# EAGLE schematic ADS1299-shield (EAGLE 6.5.0)

## Sheet 1 of 3
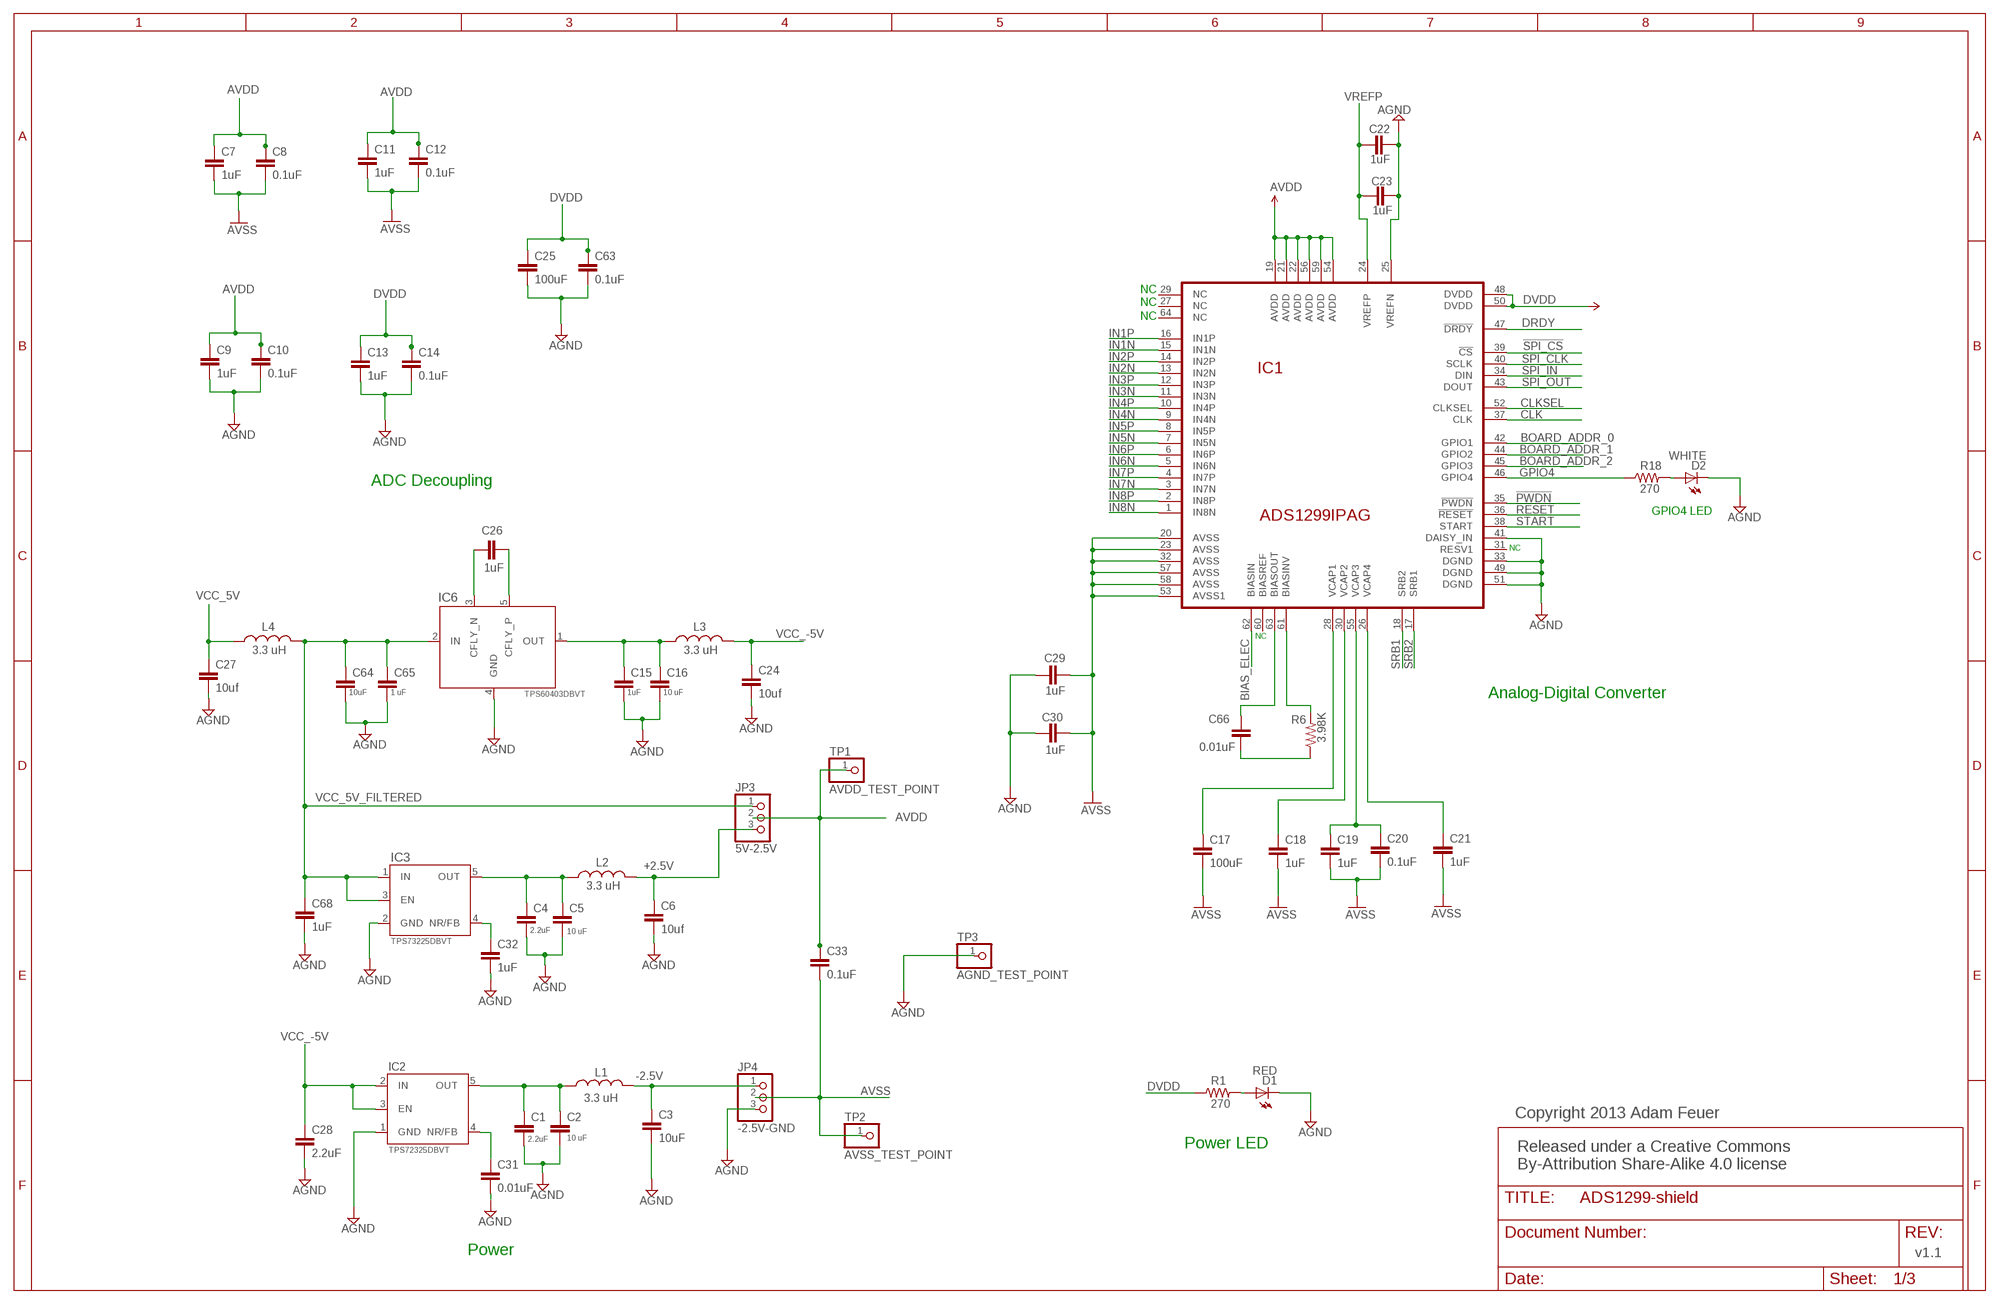
[diagram p0: schematic, sheet 1]

### Parts
C1  2.2uF  CAP0603-CAP  [0603-CAP]
C2  10 uF  CAP0603-CAP  [0603-CAP]
C3  10uF  CAP0603-CAP  [0603-CAP]
C4  2.2uF  CAP0603-CAP  [0603-CAP]
C5  10 uF  CAP0603-CAP  [0603-CAP]
C6  10uf  CAP0603-CAP  [0603-CAP]
C7  1uF  CAP0603-CAP  [0603-CAP]
C8  0.1uF  CAP0603-CAP  [0603-CAP]
C9  1uF  CAP0603-CAP  [0603-CAP]
C10  0.1uF  CAP0603-CAP  [0603-CAP]
C11  1uF  CAP0603-CAP  [0603-CAP]
C12  0.1uF  CAP0603-CAP  [0603-CAP]
C13  1uF  CAP0603-CAP  [0603-CAP]
C14  0.1uF  CAP0603-CAP  [0603-CAP]
C15  1uF  CAP0603-CAP  [0603-CAP]
C16  10 uF  CAP0603-CAP  [0603-CAP]
C17  100uF  CAP1210  [1210]
C18  1uF  CAP0603-CAP  [0603-CAP]
C19  1uF  CAP0603-CAP  [0603-CAP]
C20  0.1uF  CAP0603-CAP  [0603-CAP]
C21  1uF  CAP0603-CAP  [0603-CAP]
C22  1uF  CAP0603-CAP  [0603-CAP]
C23  1uF  CAP0603-CAP  [0603-CAP]
C24  10uf  CAP0603-CAP  [0603-CAP]
C25  100uF  CAP1210  [1210]
C26  1uF  CAP0603-CAP  [0603-CAP]
C27  10uf  CAP0603-CAP  [0603-CAP]
C28  2.2uF  CAP0603-CAP  [0603-CAP]
C29  1uF  CAP0603-CAP  [0603-CAP]
C30  1uF  CAP0603-CAP  [0603-CAP]
C31  0.01uF  CAP0603-CAP  [0603-CAP]
C32  1uF  CAP0603-CAP  [0603-CAP]
C33  0.1uF  CAP0603-CAP  [0603-CAP]
C63  0.1uF  CAP0603-CAP  [0603-CAP]
C64  10uF  CAP0603-CAP  [0603-CAP]
C65  1 uF  CAP0603-CAP  [0603-CAP]
C66  0.01uF  CAP0603-CAP  [0603-CAP]
C68  1uF  CAP0603-CAP  [0603-CAP]
D1  RED  LED-RED1206  [LED-1206]
D2  WHITE  LED-WHITE  [LED-1206]
IC1  ADS1299IPAG  ADS1299*PAG*  [TQFP64]
IC2  TPS72325DBVT  TPS732XXDBV  [SOT23-5]
IC3  TPS73225DBVT  TPS732XXDBV  [SOT23-5]
IC6  TPS60403DBVT  TPS604XXDBV  [SOT23-5]
JP3  5V-2.5V  PINHD-1X3  [1X03]
JP4  -2.5V-GND  PINHD-1X3  [1X03]
L1  3.3 uH  INDUCTOR0805  [0805]
L2  3.3 uH  INDUCTOR0805  [0805]
L3  3.3 uH  INDUCTOR0805  [0805]
L4  3.3 uH  INDUCTOR0805  [0805]
R1  270  RESISTOR0603-RES  [0603-RES]
R6  3.98K  RESISTOR0603-RES  [0603-RES]
R18  270  RESISTOR0603-RES  [0603-RES]
TP1  AVDD_TEST_POINT  PINHD-1X1  [1X01]
TP2  AVSS_TEST_POINT  PINHD-1X1  [1X01]
TP3  AGND_TEST_POINT  PINHD-1X1  [1X01]

### Nets
!PWDN: IC1.35(!PWDN) ; also sheet 3
!RESET: IC1.36(!RESET) ; also sheet 3
!SPI_CS: IC1.39(!CS) ; also sheet 3
+2.5V: C6.1 JP3.3 L2.2
-2.5V: C3.1 JP4.1 L1.2
AGND: C1.2 C2.2 C3.2 C4.2 C5.2 C6.2 C9.2 C10.2 C13.2 C14.2 C15.2 C16.2 C22.2 C23.2 C24.2 C25.2 C27.2 C28.2 C29.1 C30.1 C31.2 C32.2 C63.2 C64.2 C65.2 C68.2 D1.C D2.C IC1.25(VREFN) IC1.33(DGND) IC1.41(DAISY_IN) IC1.49(DGND) IC1.51(DGND) IC2.1(GND) IC3.2(GND) IC6.4(GND) JP4.3 TP3.1 ; also sheet 2,3
AVDD: C7.1 C8.1 C9.1 C10.1 C11.1 C12.1 C33.1 IC1.19(AVDD) IC1.21(AVDD) IC1.22(AVDD) IC1.54(AVDD) IC1.56(AVDD) IC1.59(AVDD) JP3.2 TP1.1 ; also sheet 2
AVSS: C7.2 C8.2 C11.2 C12.2 C17.2 C18.2 C19.2 C20.2 C21.2 C29.2 C30.2 C33.2 IC1.20(AVSS) IC1.23(AVSS) IC1.32(AVSS) IC1.53(AVSS1) IC1.57(AVSS) IC1.58(AVSS) JP4.2 TP2.1 ; also sheet 2
BIAS_ELEC: IC1.62(BIASIN) ; also sheet 2
BOARD_ADDR_0: IC1.42(GPIO1) ; also sheet 3
BOARD_ADDR_1: IC1.44(GPIO2) ; also sheet 3
BOARD_ADDR_2: IC1.45(GPIO3) ; also sheet 3
CLK: IC1.37(CLK) ; also sheet 3
CLKSEL: IC1.52(CLKSEL) ; also sheet 3
DRDY: IC1.47(!DRDY) ; also sheet 3
DVDD: C13.1 C14.1 C25.1 C63.1 IC1.48(DVDD) IC1.50(DVDD) R1.1 ; also sheet 2,3
GPIO4: IC1.46(GPIO4) R18.1
IN1N: IC1.15(IN1N) ; also sheet 2
IN1P: IC1.16(IN1P) ; also sheet 2
IN2N: IC1.13(IN2N) ; also sheet 2
IN2P: IC1.14(IN2P) ; also sheet 2
IN3N: IC1.11(IN3N) ; also sheet 2
IN3P: IC1.12(IN3P) ; also sheet 2
IN4N: IC1.9(IN4N) ; also sheet 2
IN4P: IC1.10(IN4P) ; also sheet 2
IN5N: IC1.7(IN5N) ; also sheet 2
IN5P: IC1.8(IN5P) ; also sheet 2
IN6N: IC1.5(IN6N) ; also sheet 2
IN6P: IC1.6(IN6P) ; also sheet 2
IN7N: IC1.3(IN7N) ; also sheet 2
IN7P: IC1.4(IN7P) ; also sheet 2
IN8N: IC1.1(IN8N) ; also sheet 2
IN8P: IC1.2(IN8P) ; also sheet 2
N$1: C4.1 C5.1 IC3.5(OUT) L2.1
N$2: C1.1 C2.1 IC2.5(OUT) L1.1
N$3: C17.1 IC1.28(VCAP1)
N$4: C18.1 IC1.30(VCAP2)
N$5: C19.1 C20.1 IC1.55(VCAP3)
N$7: C15.1 C16.1 IC6.1(OUT) L3.1
N$8: C21.1 IC1.26(VCAP4)
N$9: C26.2 IC6.5(CFLY_P)
N$10: C26.1 IC6.3(CFLY_N)
N$11: C32.1 IC3.4(NR/FB)
N$12: IC1.61(BIASINV) R6.2
N$13: C31.1 IC2.4(NR/FB)
N$14: D2.A R18.2
N$19: D1.A R1.2
N$22: C66.2 R6.1
N$25: C66.1 IC1.63(BIASOUT)
SPI_CLK: IC1.40(SCLK) ; also sheet 3
SPI_IN: IC1.34(DIN) ; also sheet 3
SPI_OUT: IC1.43(DOUT) ; also sheet 3
SRB1: IC1.18(SRB2) ; also sheet 2
SRB2: IC1.17(SRB1) ; also sheet 2
START: IC1.38(START) ; also sheet 3
VCC_5V: C27.1 L4.1 ; also sheet 3
VCC_5V_FILTERED: C64.1 C65.1 C68.1 IC3.1(IN) IC3.3(EN) IC6.2(IN) JP3.1 L4.2
VCC_-5V: C24.1 C28.1 IC2.2(IN) IC2.3(EN) L3.2
VREFP: C22.1 C23.1 IC1.24(VREFP)
Unconnected: IC1.27(NC) IC1.29(NC) IC1.31(RESV1) IC1.60(BIASREF) IC1.64(NC)

### Notes on the sheet
- NC
- NC
- NC
- ADC Decoupling
- GPIO4 LED
- NC
- NC
- Analog-Digital Converter
- Copyright 2013 Adam Feuer
- Power LED
- Released under a Creative Commons 
  By-Attribution Share-Alike 4.0 license
- Power | v1.1

## Sheet 2 of 3
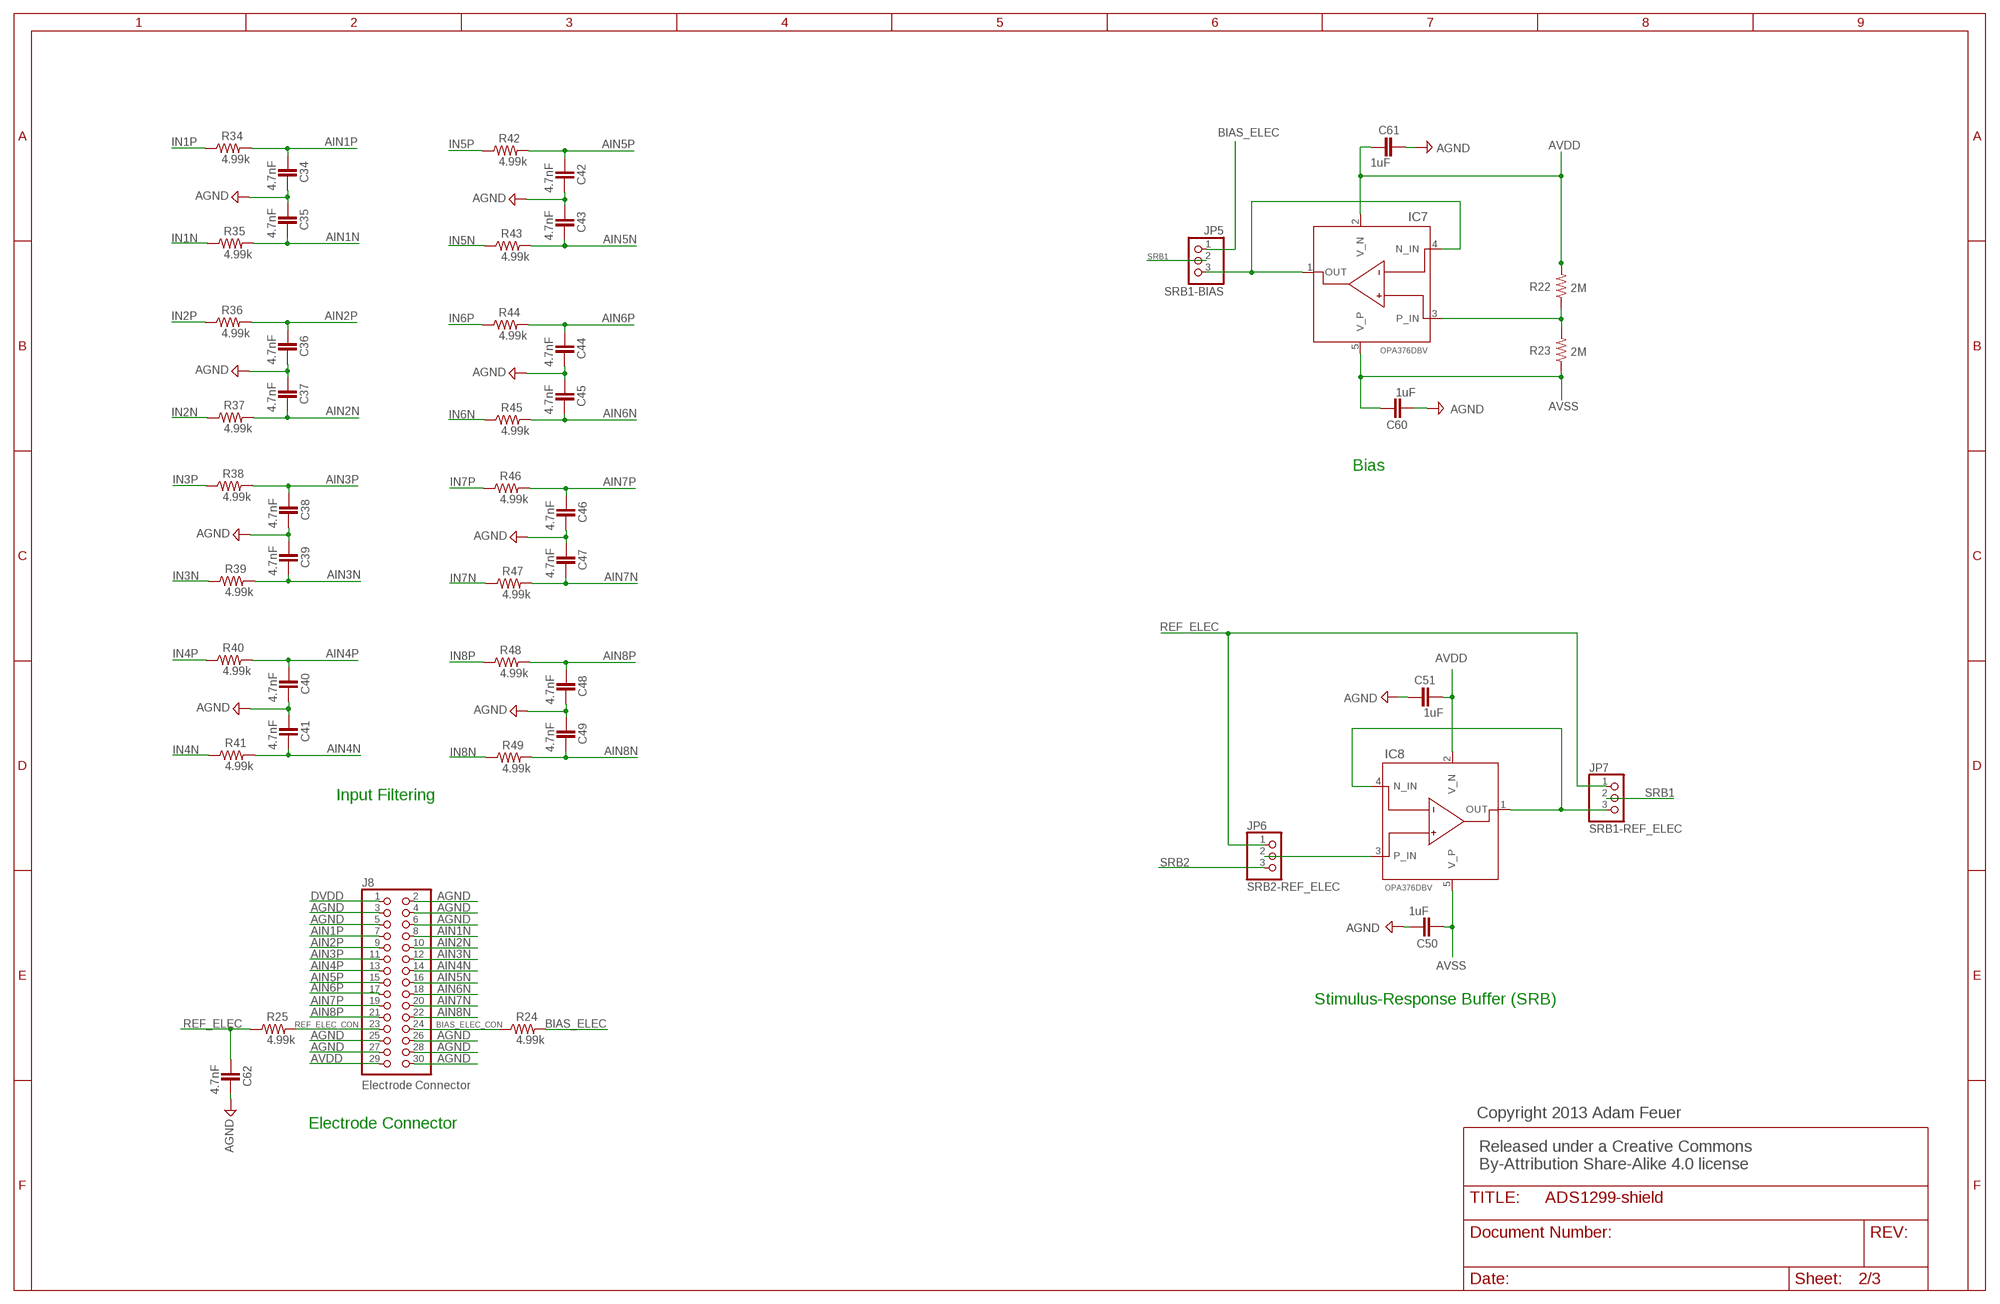
[diagram p1: schematic, sheet 2]

### Parts
C34  4.7nF  CAP0603-CAP  [0603-CAP]
C35  4.7nF  CAP0603-CAP  [0603-CAP]
C36  4.7nF  CAP0603-CAP  [0603-CAP]
C37  4.7nF  CAP0603-CAP  [0603-CAP]
C38  4.7nF  CAP0603-CAP  [0603-CAP]
C39  4.7nF  CAP0603-CAP  [0603-CAP]
C40  4.7nF  CAP0603-CAP  [0603-CAP]
C41  4.7nF  CAP0603-CAP  [0603-CAP]
C42  4.7nF  CAP0603-CAP  [0603-CAP]
C43  4.7nF  CAP0603-CAP  [0603-CAP]
C44  4.7nF  CAP0603-CAP  [0603-CAP]
C45  4.7nF  CAP0603-CAP  [0603-CAP]
C46  4.7nF  CAP0603-CAP  [0603-CAP]
C47  4.7nF  CAP0603-CAP  [0603-CAP]
C48  4.7nF  CAP0603-CAP  [0603-CAP]
C49  4.7nF  CAP0603-CAP  [0603-CAP]
C50  1uF  CAP0603-CAP  [0603-CAP]
C51  1uF  CAP0603-CAP  [0603-CAP]
C60  1uF  CAP0603-CAP  [0603-CAP]
C61  1uF  CAP0603-CAP  [0603-CAP]
C62  4.7nF  CAP0603-CAP  [0603-CAP]
IC7  OPA376DBV  [SOT23-5]
IC8  OPA376DBV  [SOT23-5]
J8  Electrode Connector  PINHD-2X15  [2X15]
JP5  SRB1-BIAS  PINHD-1X3  [1X03]
JP6  SRB2-REF_ELEC  PINHD-1X3  [1X03]
JP7  SRB1-REF_ELEC  PINHD-1X3  [1X03]
R22  2M  RESISTOR0603-RES  [0603-RES]
R23  2M  RESISTOR0603-RES  [0603-RES]
R24  4.99k  RESISTOR0603-RES  [0603-RES]
R25  4.99k  RESISTOR0603-RES  [0603-RES]
R34  4.99k  RESISTOR0603-RES  [0603-RES]
R35  4.99k  RESISTOR0603-RES  [0603-RES]
R36  4.99k  RESISTOR0603-RES  [0603-RES]
R37  4.99k  RESISTOR0603-RES  [0603-RES]
R38  4.99k  RESISTOR0603-RES  [0603-RES]
R39  4.99k  RESISTOR0603-RES  [0603-RES]
R40  4.99k  RESISTOR0603-RES  [0603-RES]
R41  4.99k  RESISTOR0603-RES  [0603-RES]
R42  4.99k  RESISTOR0603-RES  [0603-RES]
R43  4.99k  RESISTOR0603-RES  [0603-RES]
R44  4.99k  RESISTOR0603-RES  [0603-RES]
R45  4.99k  RESISTOR0603-RES  [0603-RES]
R46  4.99k  RESISTOR0603-RES  [0603-RES]
R47  4.99k  RESISTOR0603-RES  [0603-RES]
R48  4.99k  RESISTOR0603-RES  [0603-RES]
R49  4.99k  RESISTOR0603-RES  [0603-RES]

### Nets
AGND: C34.2 C35.1 C36.2 C37.1 C38.2 C39.1 C40.2 C41.1 C42.2 C43.1 C44.2 C45.1 C46.2 C47.1 C48.2 C49.1 C50.2 C51.1 C60.2 C61.1 C62.2 J8.2 J8.3 J8.4 J8.5 J8.6 J8.25 J8.26 J8.27 J8.28 J8.30 ; also sheet 1,3
AIN1N: C35.2 J8.8 R35.2
AIN1P: C34.1 J8.7 R34.2
AIN2N: C37.2 J8.10 R37.2
AIN2P: C36.1 J8.9 R36.2
AIN3N: C39.2 J8.12 R39.2
AIN3P: C38.1 J8.11 R38.2
AIN4N: C41.2 J8.14 R41.2
AIN4P: C40.1 J8.13 R40.2
AIN5N: C43.2 J8.16 R43.2
AIN5P: C42.1 J8.15 R42.2
AIN6N: C45.2 J8.18 R45.2
AIN6P: C44.1 J8.17 R44.2
AIN7N: C47.2 J8.20 R47.2
AIN7P: C46.1 J8.19 R46.2
AIN8N: C49.2 J8.22 R49.2
AIN8P: C48.1 J8.21 R48.2
AVDD: C51.2 C61.2 IC7.2(V_N) IC8.2(V_N) J8.29 R22.2 ; also sheet 1
AVSS: C50.1 C60.1 IC7.5(V_P) IC8.5(V_P) R23.1 ; also sheet 1
BIAS_ELEC: JP5.1 R24.2 ; also sheet 1
BIAS_ELEC_CON: J8.24 R24.1
DVDD: J8.1 ; also sheet 1,3
IN1N: R35.1 ; also sheet 1
IN1P: R34.1 ; also sheet 1
IN2N: R37.1 ; also sheet 1
IN2P: R36.1 ; also sheet 1
IN3N: R39.1 ; also sheet 1
IN3P: R38.1 ; also sheet 1
IN4N: R41.1 ; also sheet 1
IN4P: R40.1 ; also sheet 1
IN5N: R43.1 ; also sheet 1
IN5P: R42.1 ; also sheet 1
IN6N: R45.1 ; also sheet 1
IN6P: R44.1 ; also sheet 1
IN7N: R47.1 ; also sheet 1
IN7P: R46.1 ; also sheet 1
IN8N: R49.1 ; also sheet 1
IN8P: R48.1 ; also sheet 1
N$15: IC7.3(P_IN) R22.1 R23.2
N$16: IC8.3(P_IN) JP6.2
N$17: IC8.1(OUT) IC8.4(N_IN) JP7.3
N$18: IC7.1(OUT) IC7.4(N_IN) JP5.3
REF_ELEC: C62.1 JP6.1 JP7.1 R25.1
REF_ELEC_CON: J8.23 R25.2
SRB1: JP5.2 JP7.2 ; also sheet 1
SRB2: JP6.3 ; also sheet 1

### Notes on the sheet
- Bias
- Input Filtering
- Stimulus-Response Buffer (SRB)
- Copyright 2013 Adam Feuer
- Electrode Connector
- Released under a Creative Commons 
  By-Attribution Share-Alike 4.0 license

## Sheet 3 of 3: PCB Matrix Packages
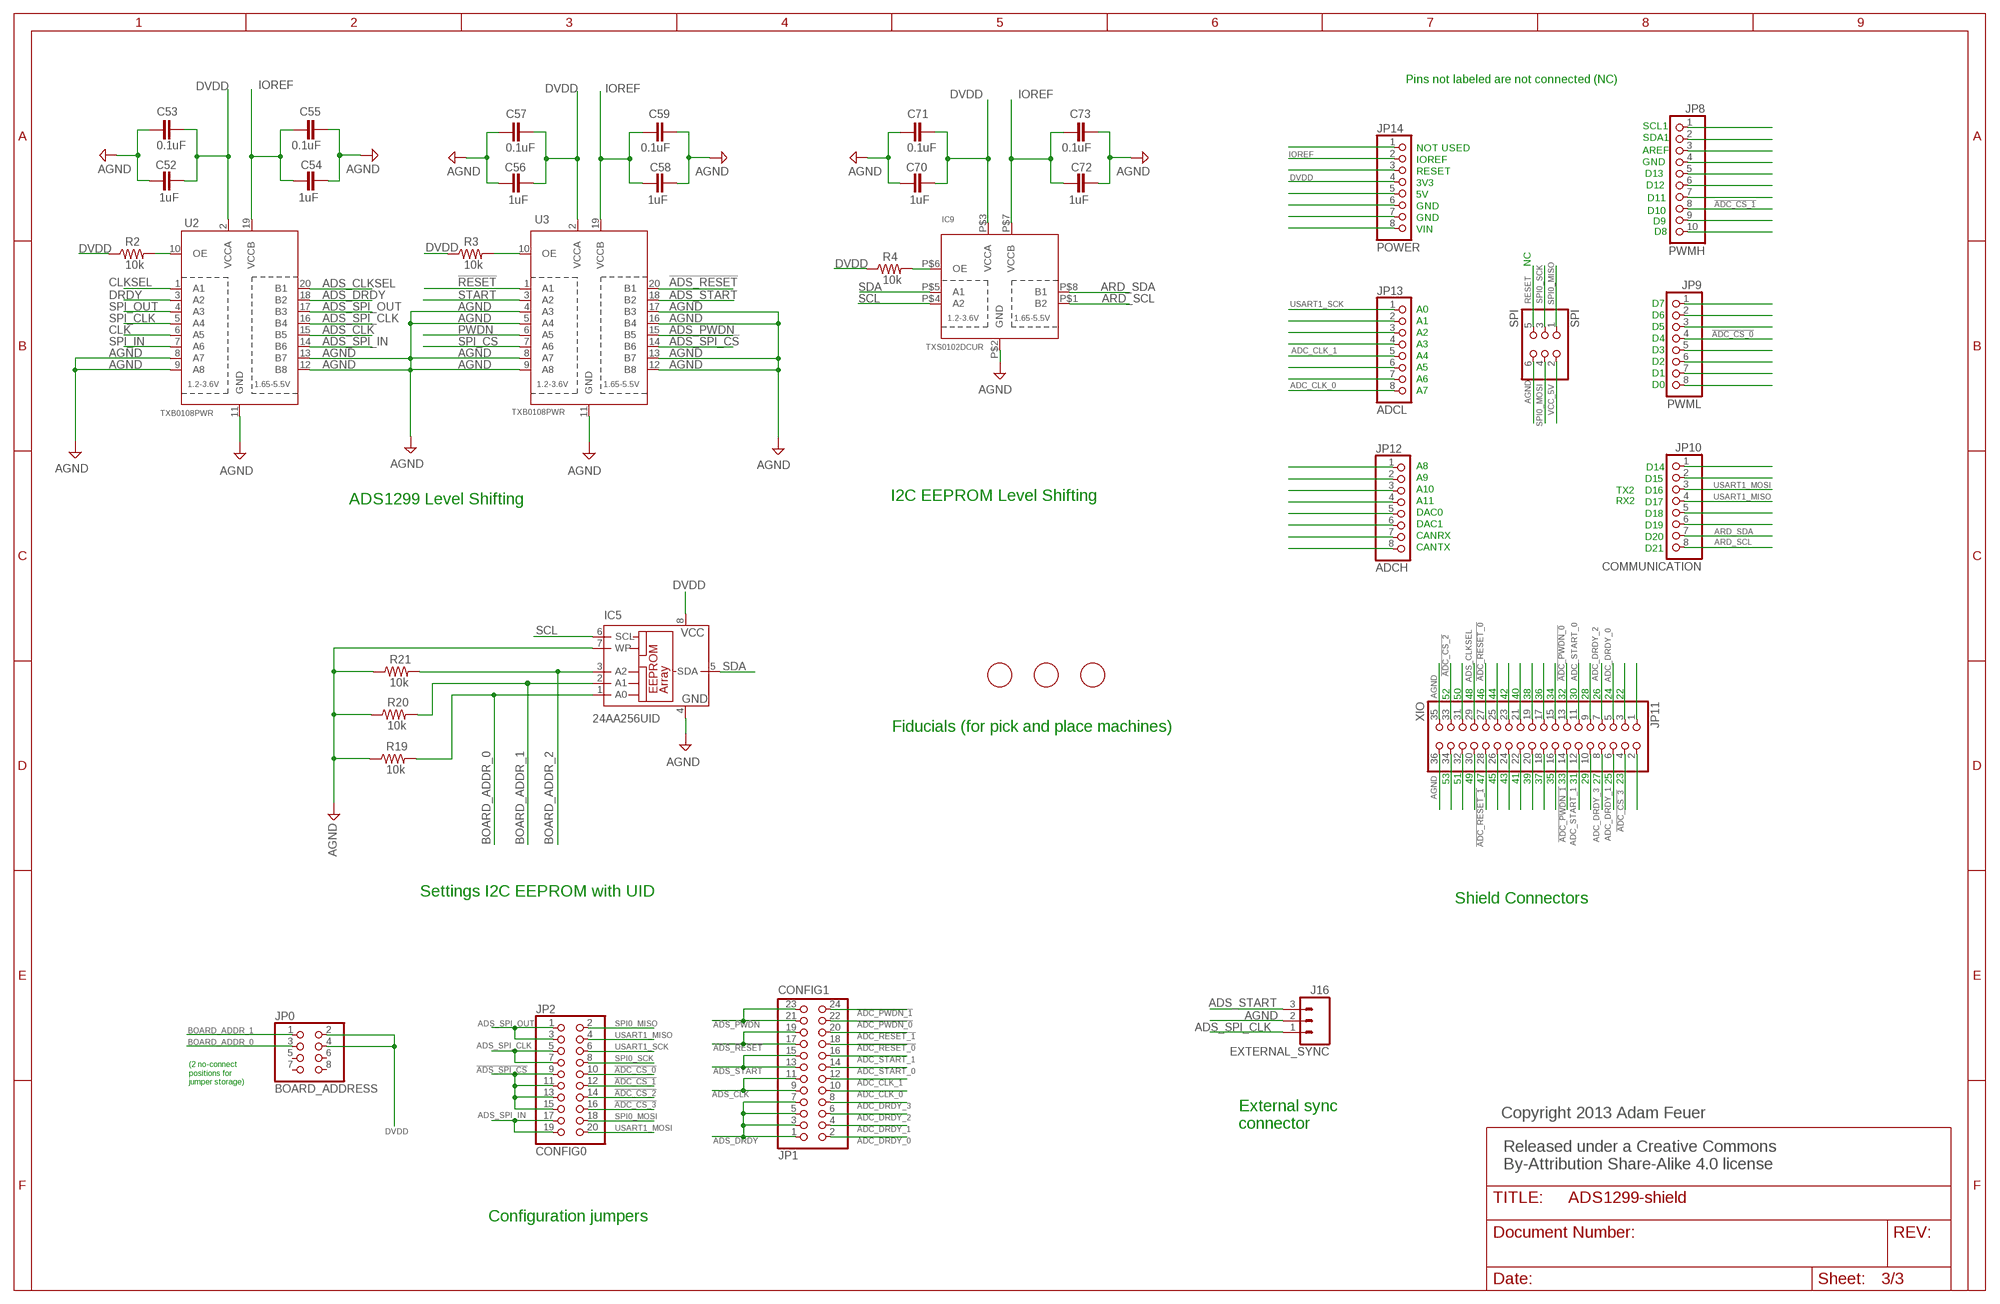
[diagram p2: schematic, sheet 3]

### Parts
C52  1uF  CAP0603-CAP  [0603-CAP]
C53  0.1uF  CAP0603-CAP  [0603-CAP]
C54  1uF  CAP0603-CAP  [0603-CAP]
C55  0.1uF  CAP0603-CAP  [0603-CAP]
C56  1uF  CAP0603-CAP  [0603-CAP]
C57  0.1uF  CAP0603-CAP  [0603-CAP]
C58  1uF  CAP0603-CAP  [0603-CAP]
C59  0.1uF  CAP0603-CAP  [0603-CAP]
C70  1uF  CAP0603-CAP  [0603-CAP]
C71  0.1uF  CAP0603-CAP  [0603-CAP]
C72  1uF  CAP0603-CAP  [0603-CAP]
C73  0.1uF  CAP0603-CAP  [0603-CAP]
IC5  24AA256UID  24LC256SN  [SO-08]
IC9  TXS0102DCUR  TXS0102  [VFSOP-8]
J16  EXTERNAL_SYNC  M03JST-PTH  [JST-3-PTH]
JP0  BOARD_ADDRESS  PINHD-2X4  [2X04]
JP1  CONFIG1  PINHD-2X12  [2X12]
JP2  CONFIG0  PINHD-2X10  [2X10]
JP8  PWMH  PINHD-1X10  [1X10]
JP9  PWML  PINHD-1X8  [1X08]
JP10  COMMUNICATION  PINHD-1X8  [1X08]
JP11  XIO  PINHD-2X18  [2X18]
JP12  ADCH  PINHD-1X8  [1X08]
JP13  ADCL  PINHD-1X8  [1X08]
JP14  POWER  PINHD-1X8  [1X08]
R2  10k  RESISTOR0603-RES  [0603-RES]
R3  10k  RESISTOR0603-RES  [0603-RES]
R4  10k  RESISTOR0603-RES  [0603-RES]
R19  10k  RESISTOR0603-RES  [0603-RES]
R20  10k  RESISTOR0603-RES  [0603-RES]
R21  10k  RESISTOR0603-RES  [0603-RES]
SPI  SPI  PINHD-2X3  [2X03]
U2  TXB0108PWR  [TSSOP20]
U3  TXB0108PWR  [TSSOP20]
U$2  FIDUCIAL  [FIDUCIAL_1MM]
U$5  FIDUCIAL  [FIDUCIAL_1MM]
U$6  FIDUCIAL  [FIDUCIAL_1MM]

### Nets
!ADC_CS_0: JP2.10 JP9.4
!ADC_CS_1: JP2.12 JP8.8
!ADC_CS_2: JP2.14 JP11.33
!ADC_CS_3: JP2.16 JP11.4
!ADC_PWDN_0: JP1.22 JP11.13
!ADC_PWDN_1: JP1.24 JP11.14
!ADC_RESET_0: JP1.18 JP11.27
!ADC_RESET_1: JP1.20 JP11.28
!ADS_PWDN: JP1.21 JP1.23 U3.15(B5)
!ADS_RESET: JP1.17 JP1.19 U3.20(B1)
!ADS_SPI_CS: JP2.9 JP2.11 JP2.13 JP2.15 U3.14(B6)
!PWDN: U3.6(A5) ; also sheet 1
!RESET: U3.1(A1) ; also sheet 1
!SPI_CS: U3.7(A6) ; also sheet 1
ADC_CLK_0: JP1.10 JP13.8
ADC_CLK_1: JP1.12 JP13.5
ADC_DRDY_0: JP1.2 JP11.5
ADC_DRDY_1: JP1.4 JP11.6
ADC_DRDY_2: JP1.6 JP11.7
ADC_DRDY_3: JP1.8 JP11.8
ADC_START_0: JP1.14 JP11.11
ADC_START_1: JP1.16 JP11.12
ADS_CLK: JP1.9 JP1.11 U2.15(B5)
ADS_CLKSEL: JP11.29 U2.20(B1)
ADS_DRDY: JP1.1 JP1.3 JP1.5 JP1.7 U2.18(B2)
ADS_SPI_CLK: J16.1 JP2.5 JP2.7 U2.16(B4)
ADS_SPI_IN: JP2.17 JP2.19 U2.14(B6)
ADS_SPI_OUT: JP2.1 JP2.3 U2.17(B3)
ADS_START: J16.3 JP1.13 JP1.15 U3.18(B2)
AGND: C52.1 C53.1 C54.1 C55.1 C56.1 C57.1 C58.1 C59.1 C70.1 C71.1 C72.1 C73.1 IC5.4(GND) IC5.7(WP) IC9.P$2(GND) J16.2 JP11.35 JP11.36 R19.1 R20.1 R21.1 SPI.6 U2.8(A7) U2.9(A8) U2.11(GND) U2.12(B8) U2.13(B7) U3.4(A3) U3.5(A4) U3.8(A7) U3.9(A8) U3.11(GND) U3.12(B8) U3.13(B7) U3.16(B4) U3.17(B3) ; also sheet 1,2
ARD_SCL: IC9.P$1(B2) JP10.8
ARD_SDA: IC9.P$8(B1) JP10.7
BOARD_ADDR_0: IC5.1(A0) JP0.3 R19.2 ; also sheet 1
BOARD_ADDR_1: IC5.2(A1) JP0.1 R20.2 ; also sheet 1
BOARD_ADDR_2: IC5.3(A2) R21.2 ; also sheet 1
CLK: U2.6(A5) ; also sheet 1
CLKSEL: U2.1(A1) ; also sheet 1
DRDY: U2.3(A2) ; also sheet 1
DVDD: C52.2 C53.2 C56.2 C57.2 C70.2 C71.2 IC5.8(VCC) IC9.P$3(VCCA) JP0.2 JP0.4 JP14.4 R2.1 R3.1 R4.1 U2.2(VCCA) U3.2(VCCA) ; also sheet 1,2
IOREF: C54.2 C55.2 C58.2 C59.2 C72.2 C73.2 IC9.P$7(VCCB) JP14.2 U2.19(VCCB) U3.19(VCCB)
N$6: JP8.9
N$20: JP12.1
N$21: JP14.1
N$24: JP9.7
N$27: JP8.3
N$28: JP8.4
N$29: JP8.5
N$30: JP8.6
N$31: JP8.7
N$33: JP8.10
N$34: JP9.1
N$35: JP9.2
N$36: JP9.3
N$37: IC9.P$6(OE) R4.2
N$38: JP9.5
N$39: JP9.6
N$40: JP9.8
N$41: JP10.1
N$42: JP10.2
N$45: JP10.5
N$46: JP10.6
N$48: JP12.8
N$49: JP12.7
N$50: JP12.6
N$51: JP12.5
N$52: JP12.4
N$53: JP12.3
N$54: JP12.2
N$59: JP13.4
N$60: JP13.3
N$61: JP13.2
N$62: JP14.8
N$63: JP14.7
N$64: JP14.6
N$67: JP14.3
N$78: JP11.34
N$79: JP11.32
N$80: JP11.30
N$82: JP11.26
N$83: JP11.24
N$84: JP11.22
N$85: JP11.20
N$86: JP11.18
N$87: JP11.16
N$90: JP11.10
N$95: JP11.3
N$98: JP11.9
N$101: JP11.15
N$102: JP11.17
N$103: JP11.19
N$104: JP11.21
N$107: JP11.23
N$108: JP11.25
N$111: JP11.31
N$501: JP13.7
N$510: JP13.6
N$561: R2.2 U2.10(OE)
N$562: R3.2 U3.10(OE)
N$570: JP14.5
N$571: JP11.1
N$572: JP11.2
N$6001: JP8.2
N$6002: JP8.1
RESET: SPI.5
SCL: IC5.6(SCL) IC9.P$4(A2)
SDA: IC5.5(SDA) IC9.P$5(A1)
SPI0_MISO: JP2.2 SPI.1
SPI0_MOSI: JP2.18 SPI.4
SPI0_SCK: JP2.8 SPI.3
SPI_CLK: U2.5(A4) ; also sheet 1
SPI_IN: U2.7(A6) ; also sheet 1
SPI_OUT: U2.4(A3) ; also sheet 1
START: U3.3(A2) ; also sheet 1
USART1_MISO: JP2.4 JP10.4
USART1_MOSI: JP2.20 JP10.3
USART1_SCK: JP2.6 JP13.1
VCC_5V: SPI.2 ; also sheet 1
Unconnected: JP0.5 JP0.6 JP0.7 JP0.8

### Notes on the sheet
- Pins not labeled are not connected (NC)
- SCL1
- SDA1
- NOT USED | AREF
- IOREF | GND
- RESET | D13
- 3V3 | D12
- 5V
- D11
- GND
- D10
- GND
- D9
- VIN | D8
- NC
- D7
- A0
- D6
- A1
- D5
- A2
- D4
- A3
- D3
- A4
- D2
- A5
- D1
- A6
- D0
- A7
- A8 | D14
- A9 | D15
- A10 | TX2 | D16
- ADS1299 Level Shifting | I2C EEPROM Level Shifting
- A11 | RX2 | D17
- DAC0 | D18
- DAC1 | D19
- CANRX | D20
- CANTX | D21
- 52 | 50 | 48 | 46 | 44 | 42 | 40 | 38 | 36 | 34 | 32 | 30 | 28 | 26 | 24 | 22
- Fiducials (for pick and place machines)
- 53 | 51 | 49 | 47 | 45 | 43 | 41 | 39 | 37 | 35 | 33 | 31 | 29 | 27 | 25 | 23
- Settings I2C EEPROM with UID
- Shield Connectors
- (2 no-connect
  positions for
  jumper storage)
- Copyright 2013 Adam Feuer
- External sync
  connector
- Released under a Creative Commons 
  By-Attribution Share-Alike 4.0 license
- Configuration jumpers

## Library data of the parts
C1-C66 C68 C70-C73 = SparkFun-Passives:CAP: Capacitor Standard 0603 ceramic capacitor, and 0.1" leaded capacitor.
D1 = SparkFun-LED:LED-RED: Assorted Red LEDs LilyPad 1206- DIO-09912 1206- DIO-00809 0603- DIO-00819; PROD_ID: DIO-00809
D2 = SparkFun-LED:LED-WHITE: White SMD LEDs LilyPad 1206- DIO-09955; PROD_ID: DIO-09955
IC1 = ADS129x:ADS1299: 8-Channel, 24-Bit Analog-To-Digital Converter With Integrated EEG Front End. ADS1299 modifications by Adam Feuer (adam@adamfeuer.com) Based on ADS1298: Drawn 23.07.2011 by Tomasz Boleslaw CEDRO (http://www.tomek.cedro.info).
IC2 = TPS723xx:TPS732XX: Cap-Free, NMOS, 250mA Low Dropout Regulator with Reverse Current Protection
IC3 = TPS32xx:TPS732XX: Cap-Free, NMOS, 250mA Low Dropout Regulator with Reverse Current Protection
IC5 = microchip:24*: Serial EEPROM I2C; MF: MICROCHIP; MPN: 24LC256-I/SN; OC_FARNELL: 9757996; OC_NEWARK: 27C9144
IC6 = TPS604xx:TPS604XX: 60mA Charge Pump Voltage Inverter with Fixed 250kHz Operation
IC7 IC8 = OPA376:OPA376: Low-Noise, Low Quiescent Current, Precision Operational Amplifier
IC9 = adafruit:TXS0102: 2-Bit Bi-Directional Level Shifter (I2C, etc.) Designed for I2C devices and has internal pullups. Not to be confused with TXB010x series. 1.2V-3.6V (VCCA) to 1.65V-5.5V (VCCB) bi-directional level shifter with auto direction sensing. Max data rate - 24Mbps (Push Pull), 2Mbps (Open Drain) Digikey: 296-21931-1-ND
J8 = headers:PINHD-2X15: PIN HEADER
J16 = SparkFun-Connectors:M03: Header 3 Standard 3-pin 0.1" header. Use with straight break away headers (SKU : PRT-00116), right angle break away headers (PRT-00553), swiss pins (PRT-00743), machine pins (PRT-00117), and female headers (PRT-00115). Molex polarized connector foot print use with SKU : PRT-08232 with associated crimp pins and housings.; SKU: PRT-09915
JP0 = headers:PINHD-2X4: PIN HEADER
JP1 = headers:PINHD-2X12: PIN HEADER
JP2 = headers:PINHD-2X10: PIN HEADER
JP3 JP4 = headers:PINHD-1X3: PIN HEADER
JP5-JP7 = adafruit:PINHD-1X3: PIN HEADER
JP8 = SmartPrj:PINHD-1X10: PIN HEADER
JP9 JP10 JP12-JP14 = SmartPrj:PINHD-1X8: PIN HEADER
JP11 = SmartPrj:PINHD-2X18: PIN HEADER
L1-L4 = SparkFun-Passives:INDUCTOR: Inductors Basic Inductor/Choke - 0603 and 1206. Footprints are not proven and vary greatly between part numbers. SRN6045- 33uH, 20% 1.4A
R1-R4 R6 R18-R25 R34-R49 = SparkFun-Passives:RESISTOR: Resistor Basic schematic elements and footprints for 0603, 1206, and PTH resistors.
SPI = SmartPrj:PINHD-2X3: PIN HEADER
TP1-TP3 = adafruit:PINHD-1X1: Pin header 1x1 for 0.1" spacing With round pins
U2 U3 = adafruit:TXB0108PWR: 8-Bit Bi-Directional Level Shifter 1.2V-3.6V (VCCA) to 1.65V-5.5V (VCCB) bi-directional level shifter with auto direction sensing. Max data rate - VCCA 1.8V: 20Mbps (50ns), VCCA 3.3V: 100Mbps (10ns) Digikey: 296-21527-1-ND
U$2 U$5 U$6 = adafruit:FIDUCIAL: For use by pick and place machines to calibrate the vision/machine, 1mm By microbuilder.eu